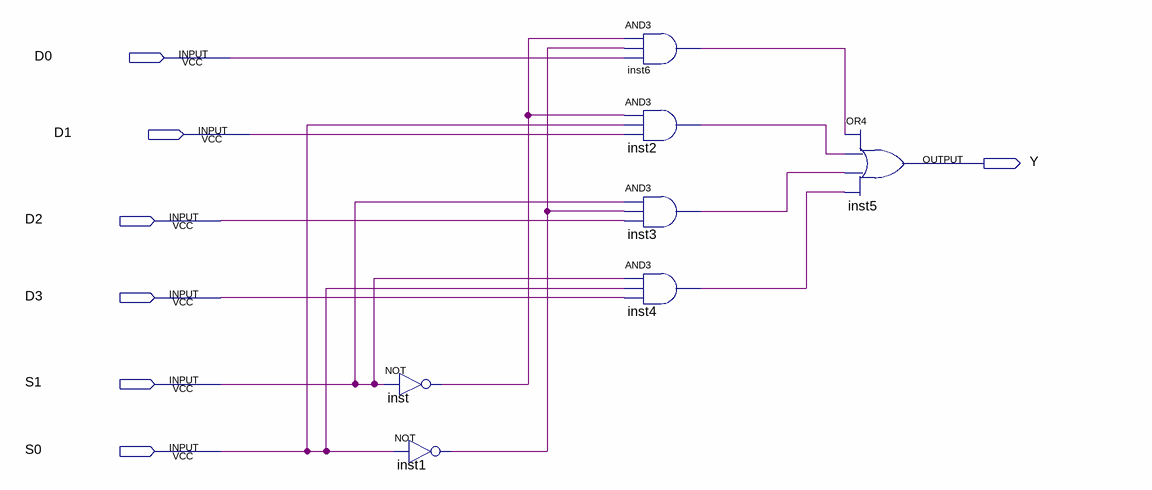
[diagram p0: schematic sheet]
// Quartus schematic mux4t01.bdf as structural Verilog: 7 symbols, 7 pins
module mux4t01 (
  input  D0,
  input  D1,
  input  D2,
  input  D3,
  input  S1,
  input  S0,
  output Y
);

  wire inst1_out, inst2_out, inst3_out, inst4_out, inst6_out, inst_out;

  not inst (inst_out, S1);
  not inst1 (inst1_out, S0);
  and inst6 (inst6_out, inst_out, inst1_out, D0);
  and inst2 (inst2_out, inst_out, S0, D1);
  and inst3 (inst3_out, S1, inst1_out, D2);
  and inst4 (inst4_out, S1, S0, D3);
  or inst5 (Y, inst6_out, inst2_out, inst3_out, inst4_out);
endmodule
